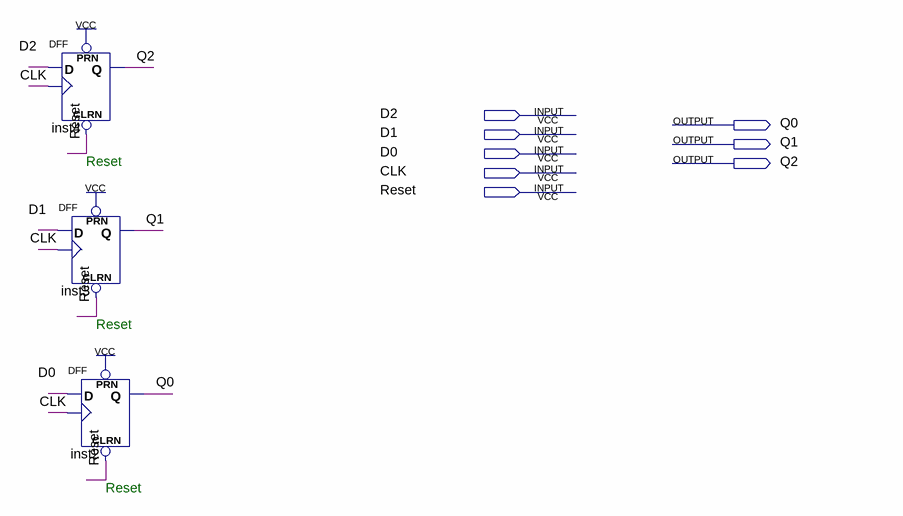
[diagram p0: schematic sheet]
// Quartus schematic lab7_part3.bdf as structural Verilog: 3 symbols, 8 pins
module lab7_part3 (
  input  D2,
  input  D1,
  input  D0,
  input  CLK,
  input  Reset,
  output Q0,
  output Q1,
  output Q2
);

  DFF inst4 (.CLRN(Reset), .CLK(CLK), .D(D2), .PRN(1'b1), .Q(Q2));
  DFF inst3 (.CLRN(Reset), .CLK(CLK), .D(D1), .PRN(1'b1), .Q(Q1));
  DFF inst2 (.CLRN(Reset), .CLK(CLK), .D(D0), .PRN(1'b1), .Q(Q0));

  // Notes on the sheet:
  //   Reset
  //   Reset
  //   Reset
endmodule
